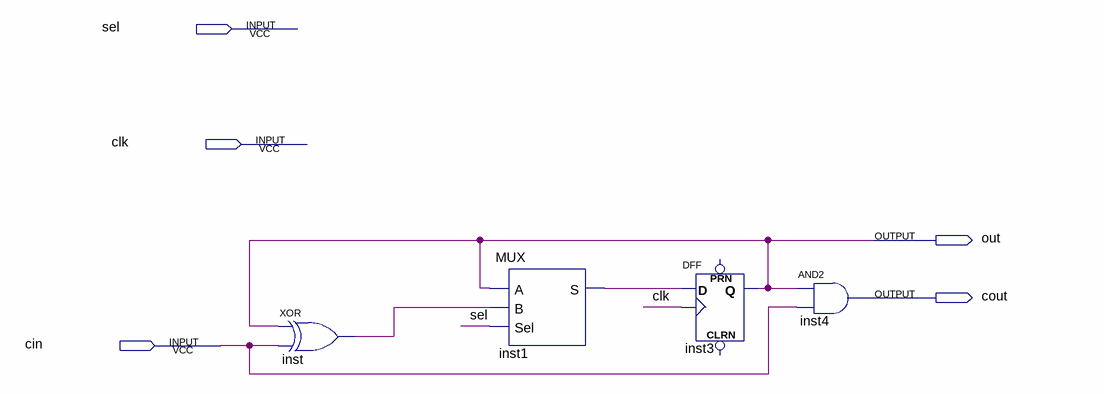
[diagram p0: schematic sheet]
// Quartus schematic 1breg.bdf as structural Verilog: 4 symbols, 5 pins
module \1breg  (
  input  sel,
  input  clk,
  input  cin,
  output out,
  output cout
);

  wire inst1_s, inst_out;

  xor inst (inst_out, out, cin);
  MUX inst1 (.A(out), .B(inst_out), .Sel(sel), .S(inst1_s));
  DFF inst3 (.CLK(clk), .D(inst1_s), .Q(out));  // open: CLRN, PRN
  and inst4 (cout, out, cin);
endmodule
